# Altium project R3P900.PrjPCB
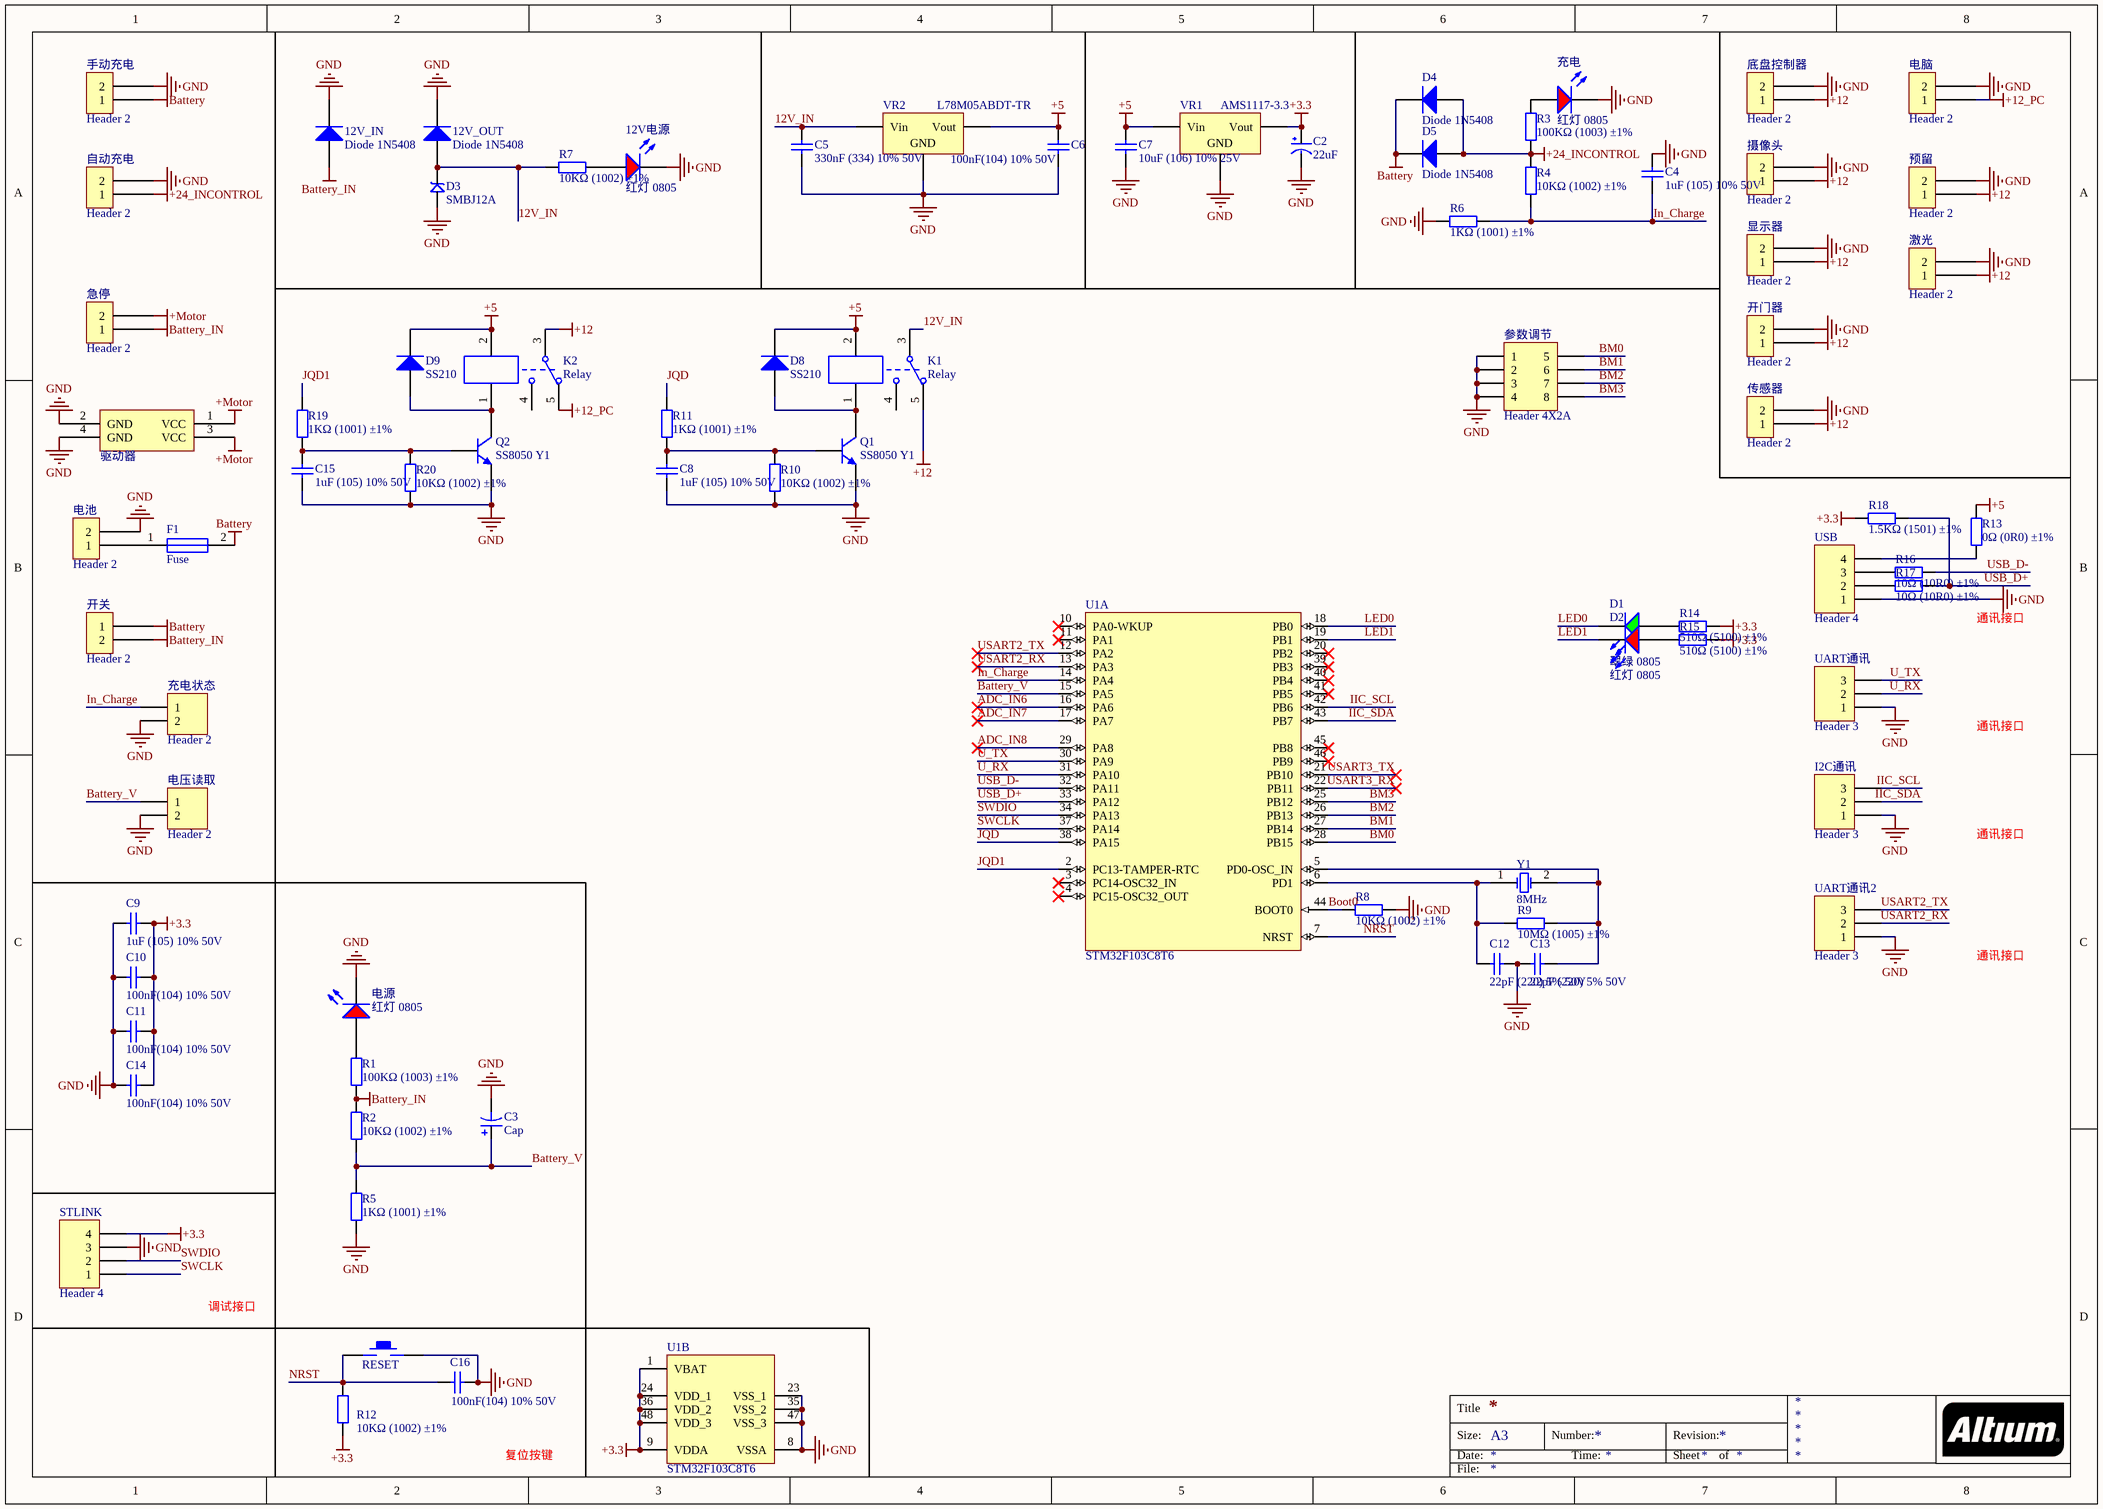
[diagram p0: R3P900.SchDoc]
1 sheet, 79 parts. Net scope: global (net labels, ports and power ports of the same name join across sheets).
Board file: R3P904.PcbDoc

## Sheet R3P900.SchDoc
size A3

### Parts
12V_IN  Diode 1N5408  [DO-201AD]
12V_OUT  Diode 1N5408  [DO-201AD]
12V电源  红灯 0805  [LC-0805_LED_S1]
C2  22uF  [CC6.56.5]
C3  Cap  [CAP-DIP-3.5]
C4  1uF (105) 10% 50V  [LC-0805_C]
C5  330nF (334) 10% 50V  [LC-0805_C]
C6  100nF(104) 10% 50V  [LC-0805_C]
C7  10uF (106) 10% 25V  [LC-0805_C]
C8  1uF (105) 10% 50V  [LC-0805_C]
C9  1uF (105) 10% 50V  [LC-0805_C]
C10  100nF(104) 10% 50V  [LC-0805_C]
C11  100nF(104) 10% 50V  [LC-0805_C]
C12  22pF (220) 5% 50V  [LC-0805_C]
C13  22pF (220) 5% 50V  [LC-0805_C]
C14  100nF(104) 10% 50V  [LC-0805_C]
C15  1uF (105) 10% 50V  [LC-0805_C]
C16  100nF(104) 10% 50V  [LC-0805_C]
D1  翠绿 0805  [LC-0805_LED_S1]
D2  红灯 0805  [LC-0805_LED_S1]
D3  SMBJ12A  [SMBJ]
D4  Diode 1N5408  [DO-201AD]
D5  Diode 1N5408  [DO-201AD]
D8  SS210  [LC-SMA(DO-214AC)_S1]
D9  SS210  [LC-SMA(DO-214AC)_S1]
F1  Fuse  [Fuse-20mm]
I2C通讯  Header 3  [HDR1X3]
K1  Relay  [JDQ-SRD-5DC]
K2  Relay  [JDQ-SRD-5DC]
Q1  SS8050 Y1  [LC-SOT-23(SOT-23-3)]
Q2  SS8050 Y1  [LC-SOT-23(SOT-23-3)]
R1  100KΩ (1003) ±1%  [LC-0805_R]
R2  10KΩ (1002) ±1%  [LC-0805_R]
R3  100KΩ (1003) ±1%  [LC-0805_R]
R4  10KΩ (1002) ±1%  [LC-0805_R]
R5  1KΩ (1001) ±1%  [LC-0805_R]
R6  1KΩ (1001) ±1%  [LC-0805_R]
R7  10KΩ (1002) ±1%  [LC-0805_R]
R8  10KΩ (1002) ±1%  [LC-0805_R]
R9  10MΩ (1005) ±1%  [LC-0805_R]
R10  10KΩ (1002) ±1%  [LC-0805_R]
R11  1KΩ (1001) ±1%  [LC-0805_R]
R12  10KΩ (1002) ±1%  [LC-0805_R]
R13  0Ω (0R0) ±1%  [LC-0603_R]
R14  510Ω (5100) ±1%  [LC-0805_R]
R15  510Ω (5100) ±1%  [LC-0805_R]
R16  10Ω (10R0) ±1%  [LC-0805_R]
R17  10Ω (10R0) ±1%  [LC-0805_R]
R18  1.5KΩ (1501) ±1%  [LC-0805_R]
R19  1KΩ (1001) ±1%  [LC-0805_R]
R20  10KΩ (1002) ±1%  [LC-0805_R]
RESET  KEY_M  [KEY_2]  (value not drawn)
STLINK  Header 4  [HDR1X4]
U1  STM32F103C8T6  [LC-LQFP-48_7x7x05P]  (parts A,B of 2)
UART通讯  Header 3  [HDR1X3]
UART通讯2  Header 3  [HDR1X3]
USB  Header 4  [HDR1X4]
VR1  AMS1117-3.3  [LC-SOT-223]
VR2  L78M05ABDT-TR  [LC-TO-252-2-180]
Y1  8MHz  [HC-49S]
传感器  Header 2  [VH-2A - Circle Hole]
充电  红灯 0805  [LC-0805_LED_S1]
充电状态  Header 2  [HDR1X2]
参数调节  Header 4X2A  [HDR2X4_CEN]
底盘控制器  Header 2  [VH-2A - Circle Hole]
开关  Header 2  [VH-2A - Circle Hole]
开门器  Header 2  [VH-2A - Circle Hole]
急停  Header 2  [VH-2A - Circle Hole]
手动充电  Header 2  [VH-2A - Circle Hole]
摄像头  Header 2  [VH-2A - Circle Hole]
显示器  Header 2  [VH-2A - Circle Hole]
激光  Header 2  [VH-2A - Circle Hole]
电压读取  Header 2  [HDR1X2]
电池  Header 2  [VH-2A - Circle Hole]
电源  红灯 0805  [LC-0805_LED_S1]
电脑  Header 2  [VH-2A - Circle Hole]
自动充电  Header 2  [VH-2A - Circle Hole]
预留  Header 2  [VH-2A - Circle Hole]
驱动器  插座  [HEADER 2X2]  (value not drawn)

### Nets
+3.3: C2.1(VCC) C9.2 C10.2 C11.2 C14.2 R12.1 R14.2 R15.2 R18.2 STLINK.4 U1.1(VBAT) U1.9(VDDA) U1.24(VDD_1) U1.36(VDD_2) U1.48(VDD_3) VR1.2(Vout)
+5: C6.2 C7.2 D8.2(K) D9.2(K) K1.2(R) K2.2(R) R13.2 VR1.3(Vin) VR2.3(Vout)
+12: K1.5(NC) K2.3(CPM) 传感器.1 底盘控制器.1 开门器.1 摄像头.1 显示器.1 激光.1 预留.1
+12_PC: K2.5(NC) 电脑.1
+24_INCONTROL: D4.1(A) D5.1(A) R3.1 R4.2 自动充电.1
+Motor: 急停.2 驱动器.1(VCC) 驱动器.3(VCC)
Battery: D4.2(K) D5.2(K) F1.2(K) 开关.1 手动充电.1
Battery_IN: 12V_IN.1(A) R1.1 R2.2 开关.2 急停.1
GND: 12V_IN.2(K) 12V_OUT.2(K) 12V电源.K C2.2(GND) C3.2 C4.2 C5.1 C6.1 C7.1 C8.1 C9.1 C10.1 C11.1 C12.2 C13.1 C14.1 C15.1 C16.1 D3.1 I2C通讯.1 Q1.2(E) Q2.2(E) R5.1 R6.1 R8.2 R10.2 R20.2 RESET.2 STLINK.3 U1.8(VSSA) U1.23(VSS_1) U1.35(VSS_2) U1.47(VSS_3) UART通讯.1 UART通讯2.1 USB.1 VR1.1(GND) VR2.2(GND) 传感器.2 充电.K 充电状态.2 参数调节.1 参数调节.2 参数调节.3 参数调节.4 底盘控制器.2 开门器.2 手动充电.2 摄像头.2 显示器.2 激光.2 电压读取.2 电池.2 电源.K 电脑.2 自动充电.2 预留.2 驱动器.2(GND) 驱动器.4(GND)
12V_IN: 12V_OUT.1(A) C5.2 D3.2 K1.3(CPM) R7.2 VR2.1(Vin)
ADC_IN6: U1.16(PA6)
ADC_IN7: U1.17(PA7)
ADC_IN8: U1.29(PA8)
Battery_V: C3.1 R2.1 R5.2 U1.15(PA5) 电压读取.1
BM0: U1.28(PB15) 参数调节.5
BM1: U1.27(PB14) 参数调节.6
BM2: U1.26(PB13) 参数调节.7
BM3: U1.25(PB12) 参数调节.8
Boot0: R8.1 U1.44(BOOT0)
IIC_SCL: I2C通讯.3 U1.42(PB6)
IIC_SDA: I2C通讯.2 U1.43(PB7)
In_Charge: C4.1 R4.1 R6.2 U1.14(PA4) 充电状态.1
JQD: R11.1 U1.38(PA15)
JQD1: R19.1 U1.2(PC13-TAMPER-RTC)
LED0: D1.K U1.18(PB0)
LED1: D2.K U1.19(PB1)
NRST: C16.2 R12.2 RESET.1 U1.7(NRST)
SWCLK: STLINK.1 U1.37(PA14)
SWDIO: STLINK.2 U1.34(PA13)
U_RX: U1.31(PA10) UART通讯.2
U_TX: U1.30(PA9) UART通讯.3
USART2_RX: U1.13(PA3) UART通讯2.2
USART2_TX: U1.12(PA2) UART通讯2.3
USART3_RX: U1.22(PB11)
USART3_TX: U1.21(PB10)
USB_D+: R17.2 R18.1 U1.33(PA12)
USB_D-: R16.2 U1.32(PA11)
Net12V电源_A: 12V电源.A R7.1
NetC8_2: C8.2 Q1.1(B) R10.1 R11.2
NetC12_1: C12.1 R9.1 U1.6(PD1) Y1.1(OSC1)
NetC13_2: C13.2 R9.2 U1.5(PD0-OSC_IN) Y1.2(OSC2)
NetC15_2: C15.2 Q2.1(B) R19.2 R20.1
NetD1_A: D1.A R14.1
NetD2_A: D2.A R15.1
NetD8_1: D8.1(A) K1.1(R) Q1.3(C)
NetD9_1: D9.1(A) K2.1(R) Q2.3(C)
NetF1_1: F1.1(A) 电池.1
NetR1_2: R1.2 电源.A
NetR3_2: R3.2 充电.A
NetR13_1: R13.1 USB.4
NetR16_1: R16.1 USB.3
NetR17_1: R17.1 USB.2

Not connected (* = marked no-connect by the designer): K1 4(NO); K2 4(NO); U1 3(PC14-OSC32_IN)* 4(PC15-OSC32_OUT)* 10(PA0-WKUP)* 11(PA1)* 20(PB2)* 39(PB3)* 40(PB4)* 41(PB5)* 45(PB8)* 46(PB9)*

### Notes on the sheet
- 通讯接口
- 调试接口
- 复位按键
- Title
- Size:
- Date:
- A3
- Number:
- Time:
- Revision:
- Sheet
- of
- File:

### Library data of the parts
12V_IN 12V_OUT D4 D5 = Diode 1N5408: 3 Amp Medium Power Silicon Rectifier Diode; Published: 8-Jun-2000; LatestRevisionDate: 17-Jul-2002; LatestRevisionNote: Re-released for DXP Platform.; DatasheetVersion: Aug-1984; PackageReference: DO-201AD; Publisher: Altium Limited; PackageDescription: Diode, Axial; Body 9.5 x 5.3 mm (LxDia. max), Lead Dia. 1.32 mm (max); ComponentLink1Description: Manufacturer Link; ComponentLink1URL: http://www.irf.com/
12V电源 D2 充电 电源 = 0805 红灯: 发光二极管; ComponentLink1Description: 供应商链接; ComponentLink1URL: http://www.szlcsc.com/product/details_2668.html; Package: 0805; Supplier: LC; SuppliersPartNumber: C2295
C2 = CAP
C3 = Cap_DIP
C4 C8 C9 C15 = 0805 1uF (105) 10% 50V: 贴片电容; ComponentLink1Description: 供应商链接; ComponentLink1URL: http://www.szlcsc.com/product/details_29074.html; Package: 0805; Supplier: LC; SuppliersPartNumber: C28323
C5 = 0805 330nF (334) 10% 50V: 贴片电容; ComponentLink1Description: 供应商链接; ComponentLink1URL: http://www.szlcsc.com/product/details_2092.html; Package: 0805; Supplier: LC; SuppliersPartNumber: C1740
C6 C10 C11 C14 C16 = 0805 100nF(104) 10% 50V: 贴片电容; ComponentLink1Description: 供应商链接; ComponentLink1URL: http://www.szlcsc.com/product/details_50686.html; Package: 0805; Supplier: LC; SuppliersPartNumber: C49678
C7 = 0805 10uF (106) 10% 25V: 贴片电容; ComponentLink1Description: 供应商链接; ComponentLink1URL: http://www.szlcsc.com/product/details_16532.html; Package: 0805; Supplier: LC; SuppliersPartNumber: C15850
C12 C13 = 0805 22pF (220) 5% 50V: 贴片电容; ComponentLink1Description: 供应商链接; ComponentLink1URL: http://www.szlcsc.com/product/details_2156.html; Package: 0805; Supplier: LC; SuppliersPartNumber: C1804
D1 = 0805 翠绿: 发光二极管; ComponentLink1Description: 供应商链接; ComponentLink1URL: http://www.szlcsc.com/product/details_2670.html; Package: 0805; Supplier: LC; SuppliersPartNumber: C2297
D3 = SMBJ: TVS
D8 D9 = SMA(DO-214AC) SS210: 二极管; ComponentLink1Description: 供应商链接; ComponentLink1URL: http://www.szlcsc.com/product/details_15669.html; Package: SMA(DO-214AC); Supplier: LC; SuppliersPartNumber: C14996
I2C通讯 UART通讯 UART通讯2 = Header 3: Header, 3-Pin; LatestRevisionDate: 17-Jul-2002; LatestRevisionNote: Re-released for DXP Platform.; Publisher: Altium Limited
K1 K2 = JDQ-SRD-5DC
Q1 Q2 = SOT-23 SS8050 Y1: 三极管; ComponentLink1Description: 供应商链接; ComponentLink1URL: http://www.szlcsc.com/product/details_2507.html; Package: SOT-23; Supplier: LC; SuppliersPartNumber: C2150
R1 R3 = 0805 100KΩ (1003) 1%: 贴片电阻; ComponentLink1Description: 供应商链接; ComponentLink1URL: http://www.szlcsc.com/product/details_18095.html; Package: 0805; Supplier: LC; SuppliersPartNumber: C17407
R2 R4 R7 R8 R10 R12 R20 = 0805 10KΩ (1002) 1%: 贴片电阻; ComponentLink1Description: 供应商链接; ComponentLink1URL: http://www.szlcsc.com/product/details_18102.html; Package: 0805; Supplier: LC; SuppliersPartNumber: C17414
R5 R6 R11 R19 = 0805 1KΩ (1001) 1%: 贴片电阻; ComponentLink1Description: 供应商链接; ComponentLink1URL: http://www.szlcsc.com/product/details_18201.html; Package: 0805; Supplier: LC; SuppliersPartNumber: C17513
R9 = 0805 10MΩ (1005) 1%: 贴片电阻; ComponentLink1Description: 供应商链接; ComponentLink1URL: http://www.szlcsc.com/product/details_26851.html; Package: 0805; Supplier: LC; SuppliersPartNumber: C26108
R13 = 0603 0Ω (0R0) 1%: 贴片电阻; ComponentLink1Description: 供应商链接; ComponentLink1URL: http://www.szlcsc.com/product/details_21903.html; Package: 0603; Supplier: LC; SuppliersPartNumber: C21189
R14 R15 = 0805 510Ω (5100) 1%: 贴片电阻; ComponentLink1Description: 供应商链接; ComponentLink1URL: http://www.szlcsc.com/product/details_18422.html; Package: 0805; Supplier: LC; SuppliersPartNumber: C17734
R16 R17 = 0805 10Ω (10R0) 1%: 贴片电阻; ComponentLink1Description: 供应商链接; ComponentLink1URL: http://www.szlcsc.com/product/details_18103.html; Package: 0805; Supplier: LC; SuppliersPartNumber: C17415
R18 = 0805 1.5KΩ (1501) 1%: 贴片电阻; ComponentLink1Description: 供应商链接; ComponentLink1URL: http://www.szlcsc.com/product/details_4717.html; Package: 0805; Supplier: LC; SuppliersPartNumber: C4310
STLINK USB = Header 4: Header, 4-Pin; LatestRevisionDate: 17-Jul-2002; LatestRevisionNote: Re-released for DXP Platform.; Publisher: Altium Limited
U1 = STM32F103C8T6: ARM; ComponentLink1Description: 供应商链接; ComponentLink1URL: http://www.szlcsc.com/product/details_9243.html; Package: LQFP-48_7x7x05P; Supplier: LC; SuppliersPartNumber: C8734
VR1 = SOT-223 AMS1117-3.3: 低压差线性稳压(LDO); ComponentLink1Description: 供应商链接; ComponentLink1URL: http://www.szlcsc.com/product/details_6652.html; Package: SOT-223; Supplier: LC; SuppliersPartNumber: C6186
VR2 = TO-252-2 L78M05ABDT-TR: 低压差线性稳压(LDO); ComponentLink1Description: 供应商链接; ComponentLink1URL: http://www.szlcsc.com/product/details_59107.html; Package: TO-252-2; Supplier: LC; SuppliersPartNumber: C58069
Y1 = XTAL: Crystal Oscillator; Published: 8-Jun-2000; LatestRevisionDate: 17-Jul-2002; LatestRevisionNote: Re-released for DXP Platform.; Publisher: Altium Limited
传感器 底盘控制器 开关 开门器 急停 手动充电 摄像头 显示器 激光 电池 电脑 自动充电 预留 = Header 2: 贴片2p座
充电状态 电压读取 = Header 2: Header, 2-Pin; LatestRevisionDate: 17-Jul-2002; LatestRevisionNote: Re-released for DXP Platform.; Publisher: Altium Limited
参数调节 = Header 4X2A: Header, 4-Pin, Dual row; LatestRevisionDate: 17-Jul-2002; LatestRevisionNote: Re-released for DXP Platform.; Publisher: Altium Limited
驱动器 = HEADER_2X2